# EasyEDA schematic Guindeau_control.json
TITLE: Sheet_2; REV: 1.0; Date: 2020-11-24; Sheet: 1/1; Drawn By: thegd; Company: Your Company
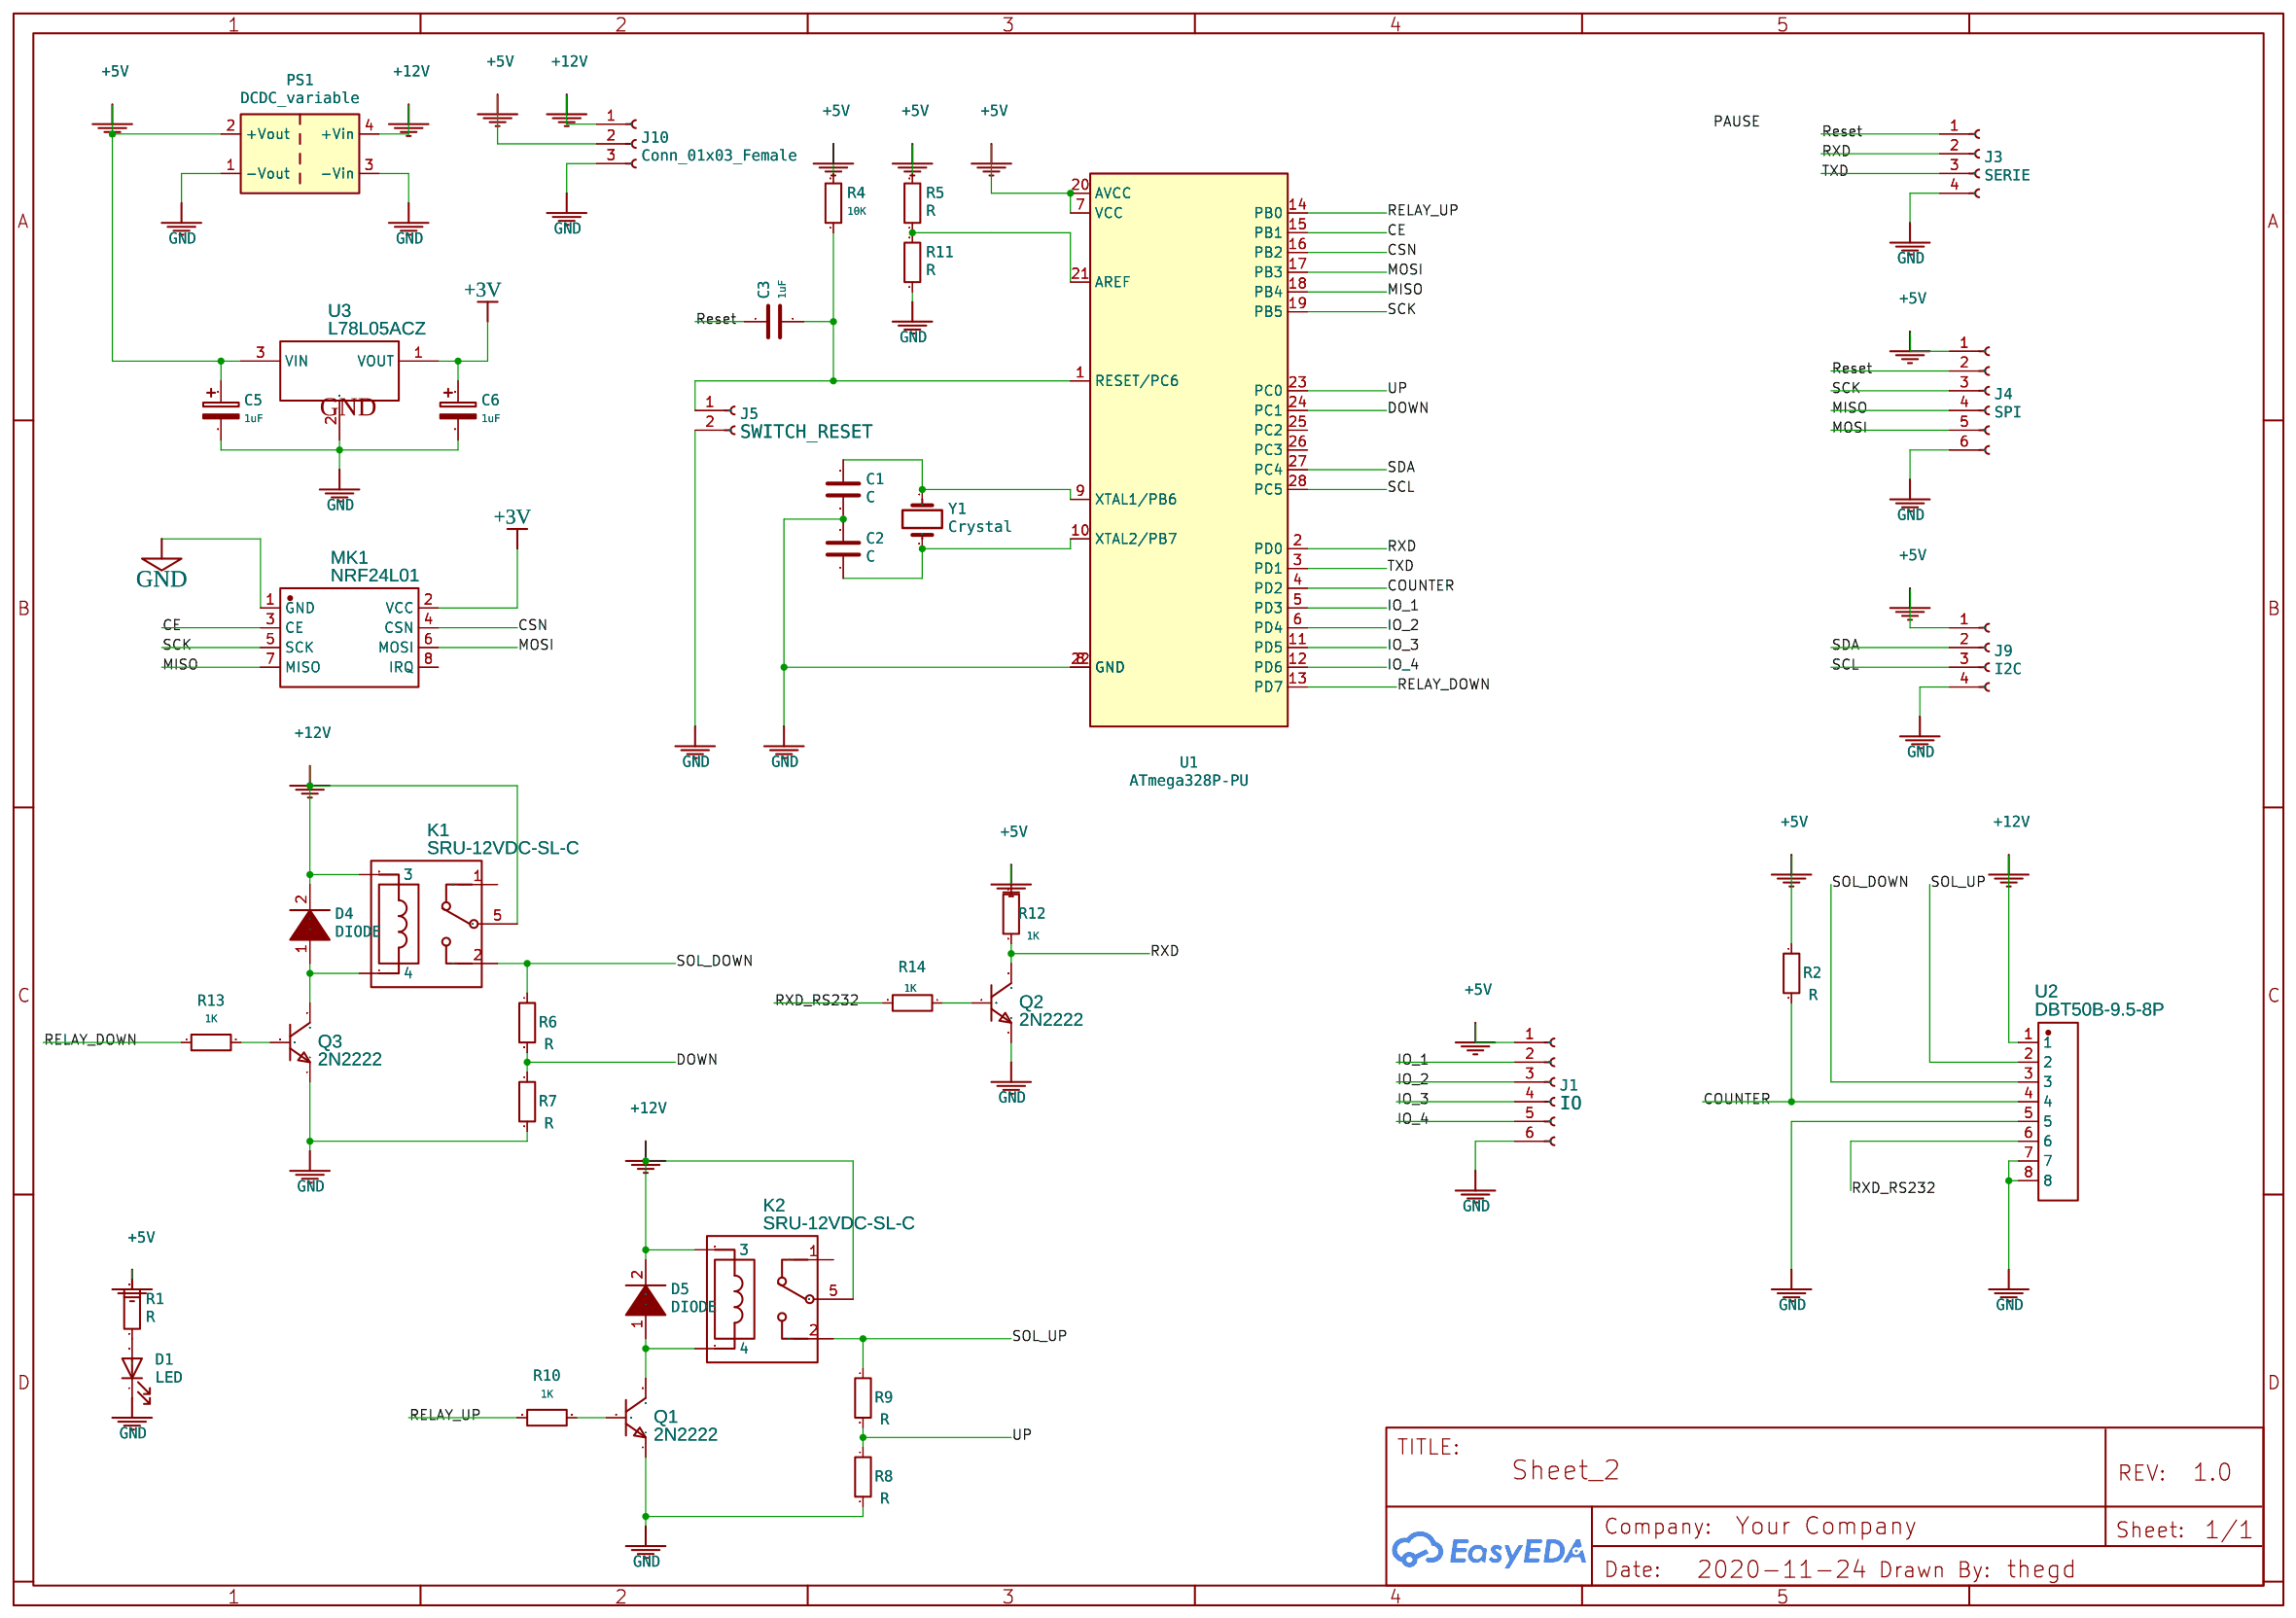
[diagram p0: schematic sheet]

## Parts
C1  C  [C_RADIAL_D5.0MM_H11.0MM_P2.00MM]
C2  C  [C_RADIAL_D5.0MM_H11.0MM_P2.00MM]
C3  1uF  [C_RADIAL_D5.0MM_H11.0MM_P2.00MM]
C5  1uF  [CP_RADIAL_D5.0MM_P2.00MM]
C6  1uF  [CP_RADIAL_D5.0MM_P2.00MM]
D1  LED  [D_A-405_P2.54MM_VERTICAL_ANODEUP]
D4  DIODE  [D_DO-41_SOD81_P7.62MM_HORIZONTAL]
D5  DIODE  [D_DO-41_SOD81_P7.62MM_HORIZONTAL]
J1  IO  [PINHEADER_1X06_P2.54MM_VERTICAL]
J3  SERIE  [PINHEADER_1X04_P2.54MM_VERTICAL]
J4  SPI  [PINHEADER_1X06_P2.54MM_VERTICAL]
J5  SWITCH_RESET  [JWT_A3963_1X02_P3.96MM_VERTICAL]
J9  I2C  [PINHEADER_1X04_P2.54MM_VERTICAL]
J10  Conn_01x03_Female  [JWT_A3963_1X03_P3.96MM_VERTICAL]
K1  SRU-12VDC-SL-C  [RELAY-TH_SRU-XX-X-C]
K2  SRU-12VDC-SL-C  [RELAY-TH_SRU-XX-X-C]
MK1  NRF24L01  [WIRELM-SMD_NRF24L01]
PS1  DCDC_variable  [DCDC_VARIABLE]
Q1  2N2222  [TO-92-3_L4.9-W3.7-P1.27-L]
Q2  2N2222  [TO-92-3_L4.9-W3.7-P1.27-L]
Q3  2N2222  [TO-92-3_L4.9-W3.7-P1.27-L]
R1  R  [R_AXIAL_DIN0204_L3.6MM_D1.6MM_P7.62MM_HORIZONTAL]
R2  R  [R_AXIAL_DIN0204_L3.6MM_D1.6MM_P7.62MM_HORIZONTAL]
R4  10K  [R_AXIAL_DIN0204_L3.6MM_D1.6MM_P7.62MM_HORIZONTAL]
R5  R  [R_AXIAL_DIN0204_L3.6MM_D1.6MM_P7.62MM_HORIZONTAL]
R6  R  [R_AXIAL_DIN0204_L3.6MM_D1.6MM_P7.62MM_HORIZONTAL]
R7  R  [R_AXIAL_DIN0204_L3.6MM_D1.6MM_P7.62MM_HORIZONTAL]
R8  R  [R_AXIAL_DIN0204_L3.6MM_D1.6MM_P7.62MM_HORIZONTAL]
R9  R  [R_AXIAL_DIN0204_L3.6MM_D1.6MM_P7.62MM_HORIZONTAL]
R10  1K  [R_AXIAL_DIN0204_L3.6MM_D1.6MM_P7.62MM_HORIZONTAL]
R11  R  [R_AXIAL_DIN0204_L3.6MM_D1.6MM_P7.62MM_HORIZONTAL]
R12  1K  [R_AXIAL_DIN0204_L3.6MM_D1.6MM_P7.62MM_HORIZONTAL]
R13  1K  [R_AXIAL_DIN0204_L3.6MM_D1.6MM_P7.62MM_HORIZONTAL]
R14  1K  [R_AXIAL_DIN0204_L3.6MM_D1.6MM_P7.62MM_HORIZONTAL]
U1  ATmega328P-PU  [DIP-28_W7.62MM]
U2  DBT50B-9.5-8P  [CONN-TH_DBT50B-9.5-8P]
U3  L78L05ACZ  [TO-92-3_L4.9-W3.7-P1.27-L]
Y1  Crystal  [CRYSTAL_HC18-U_VERTICAL]

## Library data of the parts
K1 K2 = SRU-12VDC-SL-C: Supplier: LCSC; Manufacturer: SONGLE; image: //image.lceda.cn/szlcsc/C47402.jpg; Supplier Part: C47402
MK1 = NRF24L01: Supplier: LCSC; Manufacturer: Ai-Thinker; Manufacturer Part: NRF24L01+功率加强版绑定2.4Gwireless module; Supplier Part: C90751
Q1-Q3 = 2N2222: Supplier: LCSC; Manufacturer: SEMTECH; Contributor: LCSC; Supplier Part: C118536
U1 = -: Datasheet: http://ww1.microchip.com/downloads/en/DeviceDoc/ATmega328_P%20AVR%20MCU%20with%20picoPower%20Technology%20Data%20Sheet%2040001984A.pdf
U2 = DBT50B-9.5-8P: Supplier: LCSC; Supplier Part: C729817; Manufacturer: DIBO; Contributor: LCSC
U3 = L78L05ACZ: Supplier: LCSC; Manufacturer: STMicroelectronics; image: //image.lceda.cn/szlcsc/C57900.jpg; Supplier Part: C57900

## Nets
+3V: C6.1 MK1.2(VCC) U3.1(VOUT)
+5V: C5.1 J1.1(Pin) J4.1(Pin) J9.1(Pin) J10.2(Pin) PS1.2(+Vout) R1.2 R2.1 R4.2 R5.2 R12.1 U1.7(VCC) U1.20(AVCC) U3.3(VIN)
+12V: D4.2(A) D5.2(A) J10.1(Pin) K1.3 K1.5 K2.3 K2.5 PS1.4(+Vin) U2.1
GND: C1.2 C2.1 C5.2 C6.2 D1.1(K) J1.6(Pin) J3.4(Pin) J4.6(Pin) J5.2(Pin) J9.4(Pin) J10.3(Pin) MK1.1(GND) PS1.1(-Vout) PS1.3(-Vin) Q1.1(E) Q2.1(E) Q3.1(E) R7.2 R8.2 R11.1 U1.8(GND) U1.22(GND) U2.5 U2.7 U2.8 U3.2(GND)
CE: MK1.3(CE) U1.15(PB1)
COUNTER: R2.2 U1.4(PD2) U2.4
CSN: MK1.4(CSN) U1.16(PB2)
DOWN: R6.2 R7.1 U1.24(PC1)
IO_1: J1.2(Pin) U1.5(PD3)
IO_2: J1.3(Pin) U1.6(PD4)
IO_3: J1.4(Pin) U1.11(PD5)
IO_4: J1.5(Pin) U1.12(PD6)
MISO: J4.4(Pin) MK1.7(MISO) U1.18(PB4)
MOSI: J4.5(Pin) MK1.6(MOSI) U1.17(PB3)
RELAY_DOWN: R13.1 U1.13(PD7)
RELAY_UP: R10.1 U1.14(PB0)
Reset: C3.1 J3.1(Pin) J4.2(Pin)
RXD: J3.2(Pin) Q2.3(C) R12.2 U1.2(PD0)
RXD_RS232: R14.2 U2.6
SCK: J4.3(Pin) MK1.5(SCK) U1.19(PB5)
SCL: J9.3(Pin) U1.28(PC5)
SDA: J9.2(Pin) U1.27(PC4)
SOL_DOWN: K1.2 R6.1 U2.3
SOL_UP: K2.2 R9.1 U2.2
TXD: J3.3(Pin) U1.3(PD1)
UP: R8.1 R9.2 U1.23(PC0)
Net-(C1-1): C1.1 U1.9(XTAL1/PB6) Y1.1
Net-(C2-2): C2.2 U1.10(XTAL2/PB7) Y1.2
Net-(C3-2): C3.2 J5.1(Pin) R4.1 U1.1(RESET/PC6)
Net-(D1-2): D1.2(A) R1.1
Net-(D4-1): D4.1(K) K1.4 Q3.3(C)
Net-(D5-1): D5.1(K) K2.4 Q1.3(C)
Net-(Q1-2): Q1.2(B) R10.2
Net-(Q2-2): Q2.2(B) R14.1
Net-(Q3-2): Q3.2(B) R13.2
Net-(R5-1): R5.1 R11.2 U1.21(AREF)

Not connected (* = marked no-connect by the designer): K1 1; K2 1; MK1 8(IRQ); U1 25(PC2) 26(PC3)
